# Altium schematic sheet Schematic.SchDoc
size A
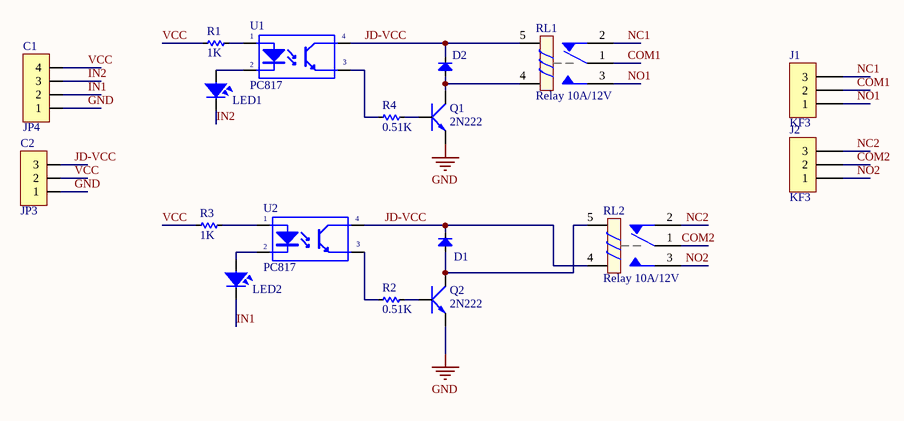
[diagram p0: Schematic.SchDoc]

## Parts
C1  JP4  [JP4-C1T]
C2  JP3  [JP3-D1T]
D1  Diode SMD  [DIO-SMD-106]  (value not drawn)
D2  Diode SMD  [DIO-SMD-106]  (value not drawn)
J1  KF3  [KF3-3.5]
J2  KF3  [KF3-3.5]
LED1  LED  [LED-0805-Red]  (value not drawn)
LED2  LED  [LED-0805-Red]  (value not drawn)
Q1  2N222  [SOT23-231]
Q2  2N222  [SOT23-231]
R1  1K  [RES-SMD-0805]
R2  0.51K  [RES-SMD-0805]
R3  1K  [RES-SMD-0805]
R4  0.51K  [RES-SMD-0805]
RL1  Relay 10A/12V  [RL_T78]
RL2  Relay 10A/12V  [RL_T78]
U1  PC817  [DIP4]
U2  PC817  [DIP4]

## Nets
GND: C1.1 C2.1 Q1.1(E) Q2.1(E)
COM1: J1.2 RL1.1
COM2: J2.2 RL2.1
IN1: C1.2 LED2.2
IN2: C1.3 LED1.2
JD-VCC: C2.3 D1.2(K) D2.2(K) RL1.5 RL2.4 U1.4(C) U2.4(C)
NC1: J1.3 RL1.2
NC2: J2.3 RL2.2
NO1: J1.1 RL1.3
NO2: J2.1 RL2.3
VCC: C1.4 C2.2 R1.2 R3.2
NetD1_1: D1.1(A) Q2.3(C) RL2.5
NetD2_1: D2.1(A) Q1.3(C) RL1.4
NetLED1_1: LED1.1 U1.2(K)
NetLED2_1: LED2.1 U2.2(K)
NetQ1_2: Q1.2(B) R4.1
NetQ2_2: Q2.2(B) R2.1
NetR1_1: R1.1 U1.1(A)
NetR2_2: R2.2 U2.3(E)
NetR3_1: R3.1 U2.1(A)
NetR4_2: R4.2 U1.3(E)

## Library data of the parts
C1 = JP4: WR-PHD 2.54 mm Angled Socket Header; Manufacturer: W¨¹rth Elektronik eiSos GmbH; partNo: 613004143121; ComponentLink1 Description: Manufacturer; ComponentLink2 Description: Datasheet; NoPins: 04; Created Date: 29 March 2013; ComponentLink1URL: http://www.we-online.com; ComponentLink2URL: http://katalog.we-online.de/em/datasheet/6130xx143121.pdf; Created by: Karrer Zheng
C2 = JP3: WR-PHD 2.54 mm Angled Socket Header; Manufacturer: W¨¹rth Elektronik eiSos GmbH; partNo: 613003143121; ComponentLink1 Description: Manufacturer; ComponentLink2 Description: Datasheet; NoPins: 03; Created Date: 29 March 2013; ComponentLink1URL: http://www.we-online.com; ComponentLink2URL: http://katalog.we-online.de/em/datasheet/6130xx143121.pdf; Created by: Karrer Zheng
D1 D2 = Diode SMD: Default Diode; Code - JEDEC: DO-214-AB; Value: 1N5007; Published: 8-Jun-2000; Revision: July-2002: Re-released for DXP Platform.; Publisher: Altium Limited
J1 J2 = KF3: Manufacturer: Würth Elektronik eiSos GmbH; partNo: 691103110003; ComponentLink1 Description: Manufacturer; ComponentLink2 Description: Datasheet; NoPins: 3; Created Date: 29 October 2013; ComponentLink1URL: http://www.we-online.com; ComponentLink2URL: http://katalog.we-online.de/em/datasheet/6911031100xx.pdf; Created by: Karrer Zheng
LED1 LED2 = LED SMD: Value: LED 3 - 5 ly 2 Colour
Q1 Q2 = 2N222: NPN 600mW, ECB; Value: C1815
R1-R4 = Res-SMD: Resistor; Manufacturer: Generic Components; Class: Passive; Published: 08/06/2000; Publisher: Altium Hobart Technology Centre
RL1 RL2 = Relay 1: Relay SPDT,10A - 12VDC 5 Pin; Value: Relay SPDT, 10A, 12V
U1 U2 = PC817: Single Opto; Value: PC817